# Altium schematic sheet 电源板.SchDoc
size A4
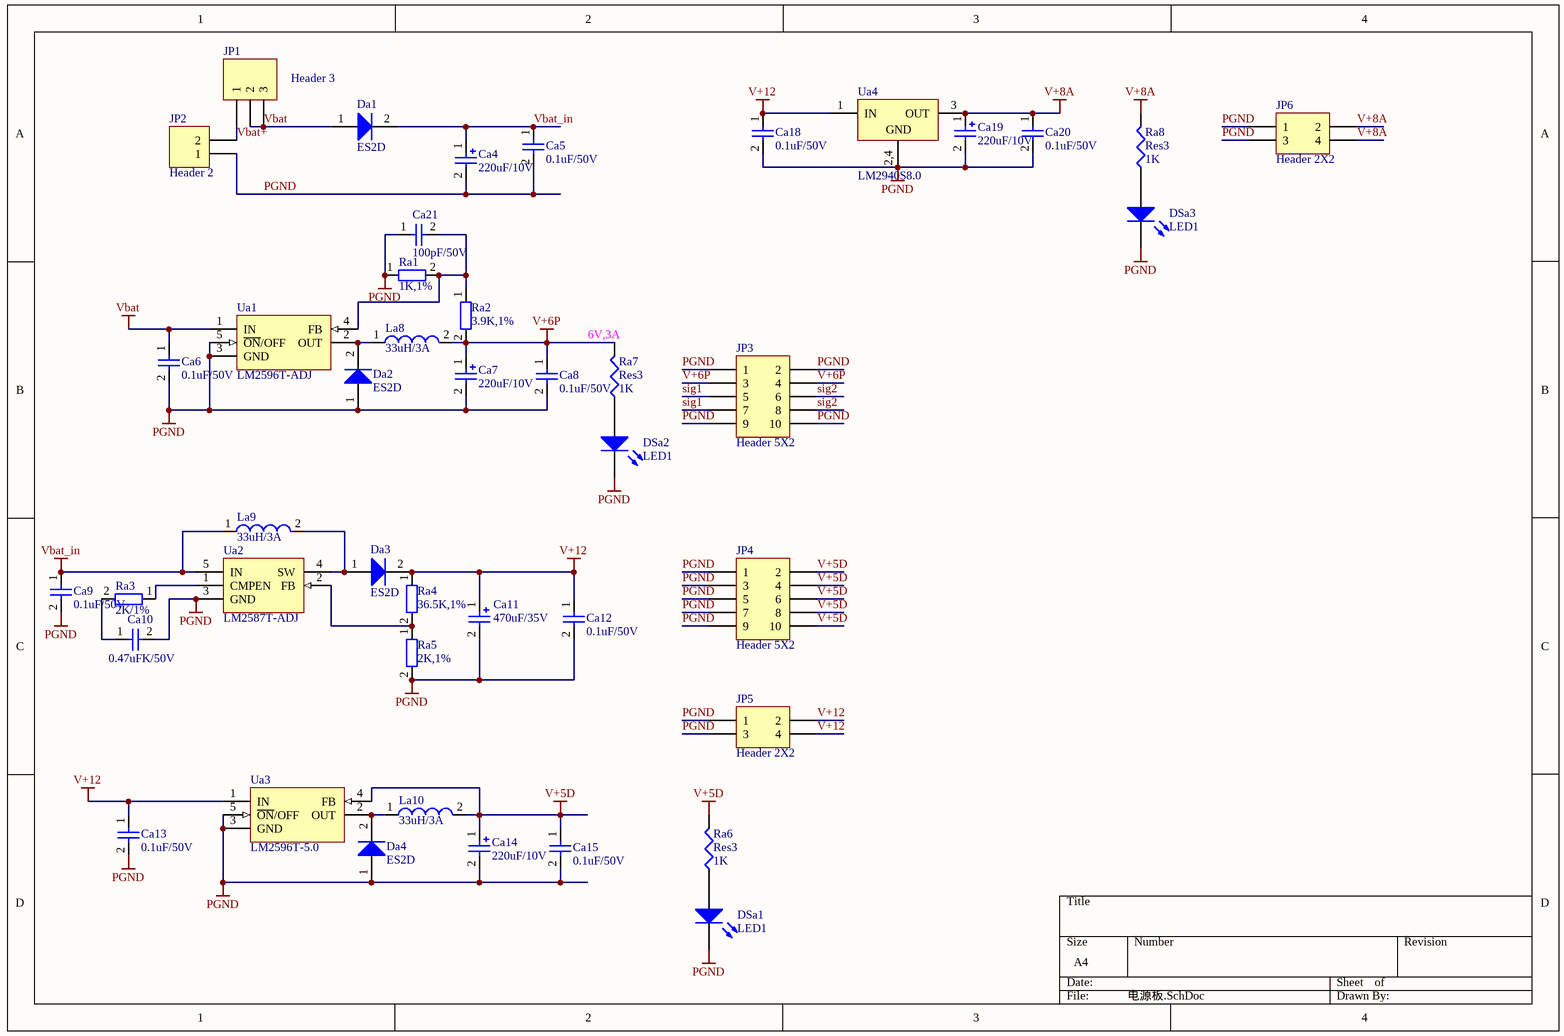
[diagram p0: 电源板.SchDoc]

## Parts
Ca4  value 220uF/10V  [470U]  (hidden comment: Cap Pol1)
Ca5  value 0.1uF/50V  [CR2012-0805]  (hidden comment: Cap)
Ca6  value 0.1uF/50V  [CR2012-0805]  (hidden comment: Cap)
Ca7  value 220uF/10V  [470U]  (hidden comment: Cap Pol1)
Ca8  value 0.1uF/50V  [CR2012-0805]  (hidden comment: Cap)
Ca9  value 0.1uF/50V  [CR2012-0805]  (hidden comment: Cap)
Ca10  value 0.47uFK/50V  [CR2012-0805]  (hidden comment: Cap)
Ca11  value 470uF/35V  [470U]  (hidden comment: Cap Pol1)
Ca12  value 0.1uF/50V  [CR2012-0805]  (hidden comment: Cap)
Ca13  value 0.1uF/50V  [CR2012-0805]  (hidden comment: Cap)
Ca14  value 220uF/10V  [100u]  (hidden comment: Cap Pol1)
Ca15  value 0.1uF/50V  [CR2012-0805]  (hidden comment: Cap)
Ca18  value 0.1uF/50V  [CR2012-0805]  (hidden comment: Cap)
Ca19  value 220uF/10V  [100u]  (hidden comment: Cap Pol1)
Ca20  value 0.1uF/50V  [CR2012-0805]  (hidden comment: Cap)
Ca21  value 100pF/50V  [CR2012-0805]  (hidden comment: Cap)
Da1  value ES2D  [DO-214-SMB-YX1]  (hidden comment: Diode_UFR)
Da2  value ES2D  [DO-214-SMB-YX1]  (hidden comment: Diode_UFR)
Da3  value ES2D  [DO-214-SMB-YX1]  (hidden comment: Diode_UFR)
Da4  value ES2D  [DO-214-SMB-YX1]  (hidden comment: Diode_UFR)
DSa1  LED1  [CR2012-0805]
DSa2  LED1  [CR2012-0805]
DSa3  LED1  [CR2012-0805]
JP1  Header 3  [KG_3]
JP2  Header 2  [CON_X2_B]
JP3  Header 5X2  [HDR2X5]
JP4  Header 5X2  [HDR2X5]
JP5  Header 2X2  [HDR2X2]
JP6  Header 2X2  [HDR2X2]
La8  value 33uH/3A  [INDUCTOR-YX14]  (hidden comment: Inductor)
La9  value 33uH/3A  [INDUCTOR-YX14]  (hidden comment: Inductor)
La10  value 33uH/3A  [INDUCTOR-YX14]  (hidden comment: Inductor)
Ra1  value 1K,1%  [CR2012-0805]  (hidden comment: Res2)
Ra2  value 3.9K,1%  [CR2012-0805]  (hidden comment: Res2)
Ra3  value 2K/1%  [CR2012-0805]  (hidden comment: Res2)
Ra4  value 36.5K,1%  [CR2012-0805]  (hidden comment: Res2)
Ra5  value 2K,1%  [CR2012-0805]  (hidden comment: Res2)
Ra6  Res3  value 1K  [CR2012-0805]
Ra7  Res3  value 1K  [CR2012-0805]
Ra8  Res3  value 1K  [CR2012-0805]
Ua1  LM2596T-ADJ  [LM2596]
Ua2  LM2587T-ADJ  [LM2596]
Ua3  LM2596T-5.0  [LM2596]
Ua4  LM2940S8.0  [SOT-223]

## Nets
PGND: Ca4.2 Ca5.2 Ca6.2 Ca7.2 Ca8.2 Ca9.2 Ca10.2 Ca11.2 Ca12.2 Ca13.2 Ca14.2 Ca15.2 Ca18.2 Ca19.2 Ca20.2 Ca21.1 Da2.1(A) Da4.1(A) DSa1.2(K) DSa2.2(K) DSa3.2(K) JP2.1 JP3.1 JP3.2 JP3.9 JP3.10 JP4.1 JP4.3 JP4.5 JP4.7 JP4.9 JP5.1 JP5.3 JP6.1 JP6.3 Ra1.1 Ra5.2 Ua1.3(GND) Ua1.5(~{ON}/OFF) Ua2.3(GND) Ua3.3(GND) Ua3.5(~{ON}/OFF) Ua4.2(GND) Ua4.4(GND)
V+5D: Ca14.1 Ca15.1 JP4.2 JP4.4 JP4.6 JP4.8 JP4.10 La10.2 Ra6.2 Ua3.4(FB)
V+6P: Ca7.1 Ca8.1 JP3.3 JP3.4 La8.2 Ra2.2 Ra7.2
V+8A: Ca19.1 Ca20.1 JP6.2 JP6.4 Ra8.2 Ua4.3(OUT)
V+12: Ca11.1 Ca12.1 Ca13.1 Ca18.1 Da3.2(K) JP5.2 JP5.4 Ra4.1 Ua3.1(IN) Ua4.1(IN)
Vbat: Ca6.1 Da1.1(A) JP1.2 JP1.3 Ua1.1(IN)
Vbat_in: Ca4.1 Ca5.1 Ca9.1 Da1.2(K) La9.1 Ua2.5(IN)
sig1: JP3.5 JP3.7
sig2: JP3.6 JP3.8
Vbat+: JP1.1 JP2.2
NetCa10_1: Ca10.1 Ra3.2
NetCa21_2: Ca21.2 Ra1.2 Ra2.1 Ua1.4(FB)
NetDa2_2: Da2.2(K) La8.1 Ua1.2(OUT)
NetDa3_1: Da3.1(A) La9.2 Ua2.4(SW)
NetDa4_2: Da4.2(K) La10.1 Ua3.2(OUT)
NetDSa1_1: DSa1.1(A) Ra6.1
NetDSa2_1: DSa2.1(A) Ra7.1
NetDSa3_1: DSa3.1(A) Ra8.1
NetRa3_1: Ra3.1 Ua2.1(CMPEN)
NetRa4_2: Ra4.2 Ra5.1 Ua2.2(FB)

## Notes on the sheet
- (near Ra7) 6V,3A
- (in symbol LM2940S8.0) 2,4

## Library data of the parts
Ca4 Ca7 Ca11 Ca14 Ca19 = Cap Pol1: Polarized Capacitor (Radial); Manufacturer: Generic Components; Class: Passive; Published: 08/06/2000; Publisher: Altium Hobart Technology Centre; SubClass: Capacitor
Ca5 Ca6 Ca8-Ca10 Ca12 Ca13 Ca15 Ca18 Ca20 Ca21 = Cap: Capacitor; Manufacturer: Generic Components; Class: Passive; Published: 08/06/2000; Publisher: Altium Hobart Technology Centre; SubClass: Capacitor
Da1-Da4 = Diode_UFR: Ultra-Fast Rectifier Diode; Manufacturer: Generic Components; Class: Discrete; SubClass: Diode - Switching; Published: 08/06/2000; Publisher: Altium Hobart Technology Centre
DSa1-DSa3 = LED1: Typical RED GaAs LED; Published: 8-Jun-2000; Revision: July-2002: Re-released for DXP Platform.; Publisher: Altium Limited
JP1 = Header 3: Header, 3-Pin; Revision: 17-Jul-2002: Re-released for DXP Platform.; Publisher: Altium Limited
JP2 = Header 2: Header, 2-Pin; Revision: 17-Jul-2002: Re-released for DXP Platform.; Publisher: Altium Limited
JP3 JP4 = Header 5X2: Header, 5-Pin, Dual row; Revision: 17-Jul-2002: Re-released for DXP Platform.; Publisher: Altium Limited
JP5 JP6 = Header 2X2: Header, 2-Pin, Dual row; Revision: 17-Jul-2002: Re-released for DXP Platform.; Publisher: Altium Limited
La8-La10 = Inductor: Manufacturer: Generic Components; Class: Passive; Published: 08/06/2000; Publisher: Altium Hobart Technology Centre; SubClass: Inductor
Ra1-Ra5 = Res2: Resistor; Manufacturer: Generic Components; Class: Passive; Published: 08/06/2000; Publisher: Altium Hobart Technology Centre; SubClass: Resistor
Ra6-Ra8 = Res3: Resistor; Published: 8-Jun-2000; Revision: July-2002: Re-released for DXP Platform.; Publisher: Altium Limited
Ua1 Ua3 = LM2596T-5.0: Simple Switcher Power Converter 150 kHz 3A Step Down Voltage Regulator; PackageDocument: 2000; Note: Tab is connected to GND; Published: 15-Apr-2002; DatasheetDocument: Dec-1997; PackageReference: T05D; Publisher: Altium Limited; ComponentLink1Description: Manufacturer Link; ComponentLink1URL: http://www.national.com/
Ua2 = LM2587T-ADJ: Simple Switcher 5A Flyback Regulator; PackageDocument: 2000; Note: Tab is connected to GND; Published: 15-Apr-2002; DatasheetDocument: Apr-1998; PackageReference: T05D; Publisher: Altium Limited; ComponentLink1Description: Manufacturer Link; ComponentLink1URL: http://www.national.com/
Ua4 = LM2940S8.0: 1A Low-Dropout Regulator; Note: Tab is GND; Published: 15-Apr-2002; Datasheet: Latest Revision: Jun-1999; Package Reference: TS3B; Publisher: Altium Limited